# Altium schematic sheet Motherboard.SchDoc
size A4; SheetNumber: 1; SheetTotal: 6
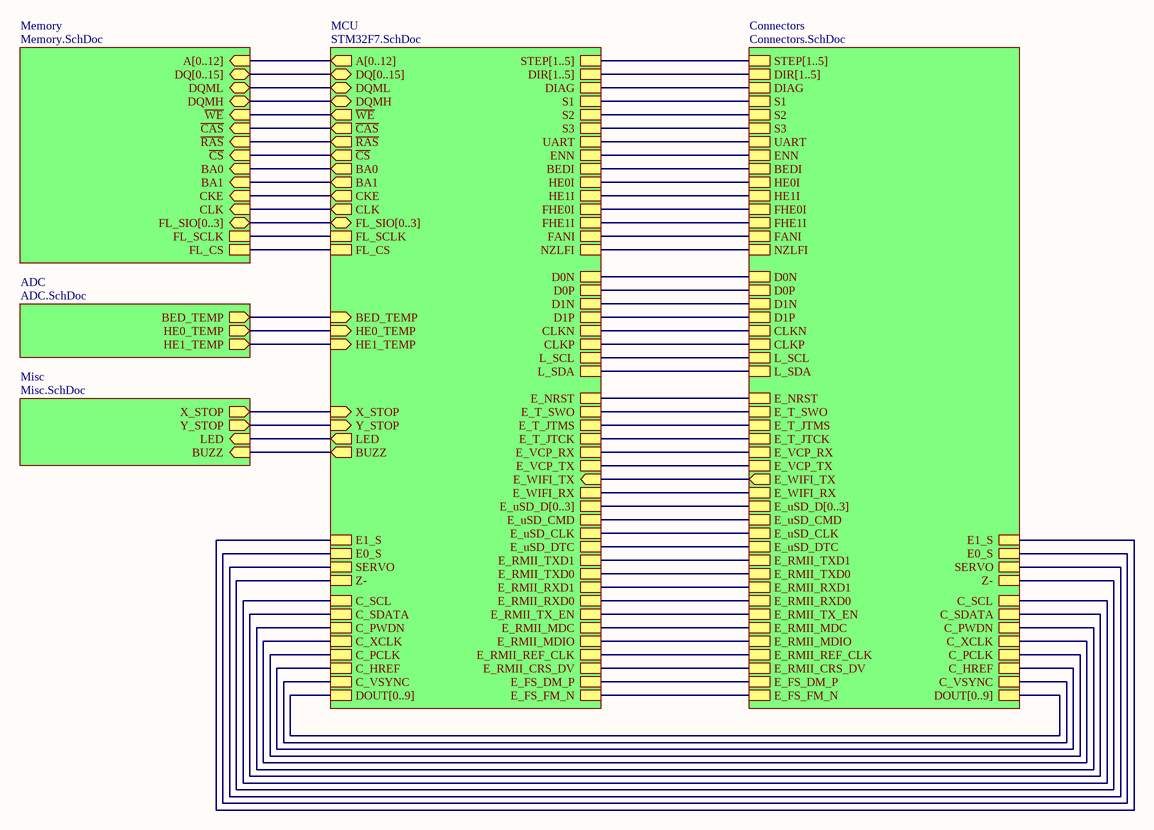
[diagram p0: Motherboard.SchDoc]

## Sub-sheets
ADC = ADC.SchDoc: BED_TEMP (out), HE0_TEMP (out), HE1_TEMP (out)
Connectors = Connectors.SchDoc: ENN, STEP[1..5], BEDI, NZLFI, FANI, UART, S3, HE0I, HE1I, S2, S1, FHE0I, FHE1I, DIR[1..5], DIAG, D1N, D1P, D0N, D0P, CLKN, CLKP, L_SCL, L_SDA, E_NRST, E_T_SWO, E_uSD_CLK, E_RMII_TXD0, E_WIFI_RX, E_uSD_D[0..3], E_VCP_RX, E_VCP_TX, E_T_JTCK, E_T_JTMS, E_uSD_DTC, E_FS_DM_P, E_FS_FM_N, E_RMII_CRS_DV, E_RMII_MDC, E_RMII_RXD0, E_RMII_TX_EN, E_uSD_CMD, E_RMII_MDIO, E_RMII_REF_CLK, E_RMII_RXD1, E_RMII_TXD1, DOUT[0..9], C_VSYNC, C_HREF, C_PCLK, C_XCLK, C_PWDN, C_SDATA, C_SCL, Z-, SERVO, E0_S, E1_S, E_WIFI_TX (out)
MCU = STM32F7.SchDoc: A[0..12] (out), DQ[0..15] (bidir), DQML (bidir), DQMH (bidir), ~{WE} (out), ~{CAS} (out), ~{RAS} (out), ~{CS} (out), BA0 (out), BA1 (out), CKE (out), CLK (out), FL_SIO[0..3] (bidir), FL_SCLK, FL_CS, BED_TEMP (in), HE0_TEMP (in), HE1_TEMP (in), X_STOP (in), Y_STOP (in), LED (out), BUZZ (out), STEP[1..5], DIR[1..5], DIAG, S1, S2, S3, UART, ENN, BEDI, HE0I, HE1I, FHE0I, FHE1I, FANI, NZLFI, D0N, D0P, D1N, D1P, CLKN, CLKP, L_SCL, L_SDA, E_NRST, E_T_SWO, E_uSD_CLK, E_RMII_TXD0, E_WIFI_RX, E_T_JTMS, E_T_JTCK, E_VCP_RX, E_VCP_TX, E_uSD_D[0..3], E_uSD_CMD, E_uSD_DTC, E_RMII_TXD1, E_RMII_RXD1, E_RMII_RXD0, E_RMII_TX_EN, E_RMII_MDC, E_RMII_MDIO, E_RMII_REF_CLK, E_RMII_CRS_DV, E_FS_DM_P, E_FS_FM_N, DOUT[0..9], C_VSYNC, C_HREF, C_PCLK, C_XCLK, C_PWDN, C_SDATA, C_SCL, Z-, SERVO, E0_S, E1_S, E_WIFI_TX (in)
Memory = Memory.SchDoc: A[0..12] (in), DQ[0..15] (bidir), DQML (bidir), DQMH (bidir), ~{WE} (in), ~{CAS} (in), ~{RAS} (in), ~{CS} (in), BA0 (in), BA1 (in), CKE (in), CLK (in), FL_SIO[0..3] (bidir), FL_SCLK, FL_CS
Misc = Misc.SchDoc: X_STOP (out), Y_STOP (out), LED (in), BUZZ (in)

## Nets
(unnamed): sheet MCU/DQML, sheet Memory/DQML
(unnamed): sheet MCU/DQMH, sheet Memory/DQMH
(unnamed): sheet MCU/~{WE}, sheet Memory/~{WE}
(unnamed): sheet MCU/~{CAS}, sheet Memory/~{CAS}
(unnamed): sheet MCU/~{RAS}, sheet Memory/~{RAS}
(unnamed): sheet MCU/~{CS}, sheet Memory/~{CS}
(unnamed): sheet MCU/BA0, sheet Memory/BA0
(unnamed): sheet MCU/BA1, sheet Memory/BA1
(unnamed): sheet MCU/CKE, sheet Memory/CKE
(unnamed): sheet MCU/CLK, sheet Memory/CLK
(unnamed): sheet MCU/FL_SCLK, sheet Memory/FL_SCLK
(unnamed): sheet MCU/FL_CS, sheet Memory/FL_CS
(unnamed): sheet MCU/BED_TEMP, sheet ADC/BED_TEMP
(unnamed): sheet MCU/HE0_TEMP, sheet ADC/HE0_TEMP
(unnamed): sheet MCU/HE1_TEMP, sheet ADC/HE1_TEMP
(unnamed): sheet MCU/X_STOP, sheet Misc/X_STOP
(unnamed): sheet MCU/Y_STOP, sheet Misc/Y_STOP
(unnamed): sheet MCU/LED, sheet Misc/LED
(unnamed): sheet MCU/BUZZ, sheet Misc/BUZZ
(unnamed): sheet MCU/DIAG, sheet Connectors/DIAG
(unnamed): sheet MCU/S1, sheet Connectors/S1
(unnamed): sheet MCU/S2, sheet Connectors/S2
(unnamed): sheet MCU/S3, sheet Connectors/S3
(unnamed): sheet MCU/UART, sheet Connectors/UART
(unnamed): sheet MCU/ENN, sheet Connectors/ENN
(unnamed): sheet MCU/BEDI, sheet Connectors/BEDI
(unnamed): sheet MCU/HE0I, sheet Connectors/HE0I
(unnamed): sheet MCU/HE1I, sheet Connectors/HE1I
(unnamed): sheet MCU/FHE0I, sheet Connectors/FHE0I
(unnamed): sheet MCU/FHE1I, sheet Connectors/FHE1I
(unnamed): sheet MCU/FANI, sheet Connectors/FANI
(unnamed): sheet MCU/NZLFI, sheet Connectors/NZLFI
(unnamed): sheet MCU/D0N, sheet Connectors/D0N
(unnamed): sheet MCU/D0P, sheet Connectors/D0P
(unnamed): sheet MCU/D1N, sheet Connectors/D1N
(unnamed): sheet MCU/D1P, sheet Connectors/D1P
(unnamed): sheet MCU/CLKN, sheet Connectors/CLKN
(unnamed): sheet MCU/CLKP, sheet Connectors/CLKP
(unnamed): sheet MCU/L_SCL, sheet Connectors/L_SCL
(unnamed): sheet MCU/L_SDA, sheet Connectors/L_SDA
(unnamed): sheet MCU/E_NRST, sheet Connectors/E_NRST
(unnamed): sheet MCU/E_T_SWO, sheet Connectors/E_T_SWO
(unnamed): sheet MCU/E_uSD_CLK, sheet Connectors/E_uSD_CLK
(unnamed): sheet MCU/E_RMII_TXD0, sheet Connectors/E_RMII_TXD0
(unnamed): sheet MCU/E_WIFI_RX, sheet Connectors/E_WIFI_RX
(unnamed): sheet MCU/E_T_JTMS, sheet Connectors/E_T_JTMS
(unnamed): sheet MCU/E_T_JTCK, sheet Connectors/E_T_JTCK
(unnamed): sheet MCU/E_VCP_RX, sheet Connectors/E_VCP_RX
(unnamed): sheet MCU/E_VCP_TX, sheet Connectors/E_VCP_TX
(unnamed): sheet MCU/E_uSD_CMD, sheet Connectors/E_uSD_CMD
(unnamed): sheet MCU/E_uSD_DTC, sheet Connectors/E_uSD_DTC
(unnamed): sheet MCU/E_RMII_TXD1, sheet Connectors/E_RMII_TXD1
(unnamed): sheet MCU/E_RMII_RXD1, sheet Connectors/E_RMII_RXD1
(unnamed): sheet MCU/E_RMII_RXD0, sheet Connectors/E_RMII_RXD0
(unnamed): sheet MCU/E_RMII_TX_EN, sheet Connectors/E_RMII_TX_EN
(unnamed): sheet MCU/E_RMII_MDC, sheet Connectors/E_RMII_MDC
(unnamed): sheet MCU/E_RMII_MDIO, sheet Connectors/E_RMII_MDIO
(unnamed): sheet MCU/E_RMII_REF_CLK, sheet Connectors/E_RMII_REF_CLK
(unnamed): sheet MCU/E_RMII_CRS_DV, sheet Connectors/E_RMII_CRS_DV
(unnamed): sheet MCU/E_FS_DM_P, sheet Connectors/E_FS_DM_P
(unnamed): sheet MCU/E_FS_FM_N, sheet Connectors/E_FS_FM_N
(unnamed): sheet MCU/C_VSYNC, sheet Connectors/C_VSYNC
(unnamed): sheet MCU/C_HREF, sheet Connectors/C_HREF
(unnamed): sheet MCU/C_PCLK, sheet Connectors/C_PCLK
(unnamed): sheet MCU/C_XCLK, sheet Connectors/C_XCLK
(unnamed): sheet MCU/C_PWDN, sheet Connectors/C_PWDN
(unnamed): sheet MCU/C_SDATA, sheet Connectors/C_SDATA
(unnamed): sheet MCU/C_SCL, sheet Connectors/C_SCL
(unnamed): sheet MCU/Z-, sheet Connectors/Z-
(unnamed): sheet MCU/SERVO, sheet Connectors/SERVO
(unnamed): sheet MCU/E0_S, sheet Connectors/E0_S
(unnamed): sheet MCU/E1_S, sheet Connectors/E1_S
(unnamed): sheet MCU/E_WIFI_TX, sheet Connectors/E_WIFI_TX

## Buses and harness runs
bus sheet Connectors/DIR[1..5] = sheet MCU/DIR[1..5]
bus sheet Connectors/DOUT[0..9] = sheet MCU/DOUT[0..9]
bus sheet Connectors/E_uSD_D[0..3] = sheet MCU/E_uSD_D[0..3]
bus sheet Connectors/STEP[1..5] = sheet MCU/STEP[1..5]
bus sheet MCU/A[0..12] = sheet Memory/A[0..12]
bus sheet MCU/DQ[0..15] = sheet Memory/DQ[0..15]
bus sheet MCU/FL_SIO[0..3] = sheet Memory/FL_SIO[0..3]